# Altium schematic sheet RF.SchDoc
size Letter
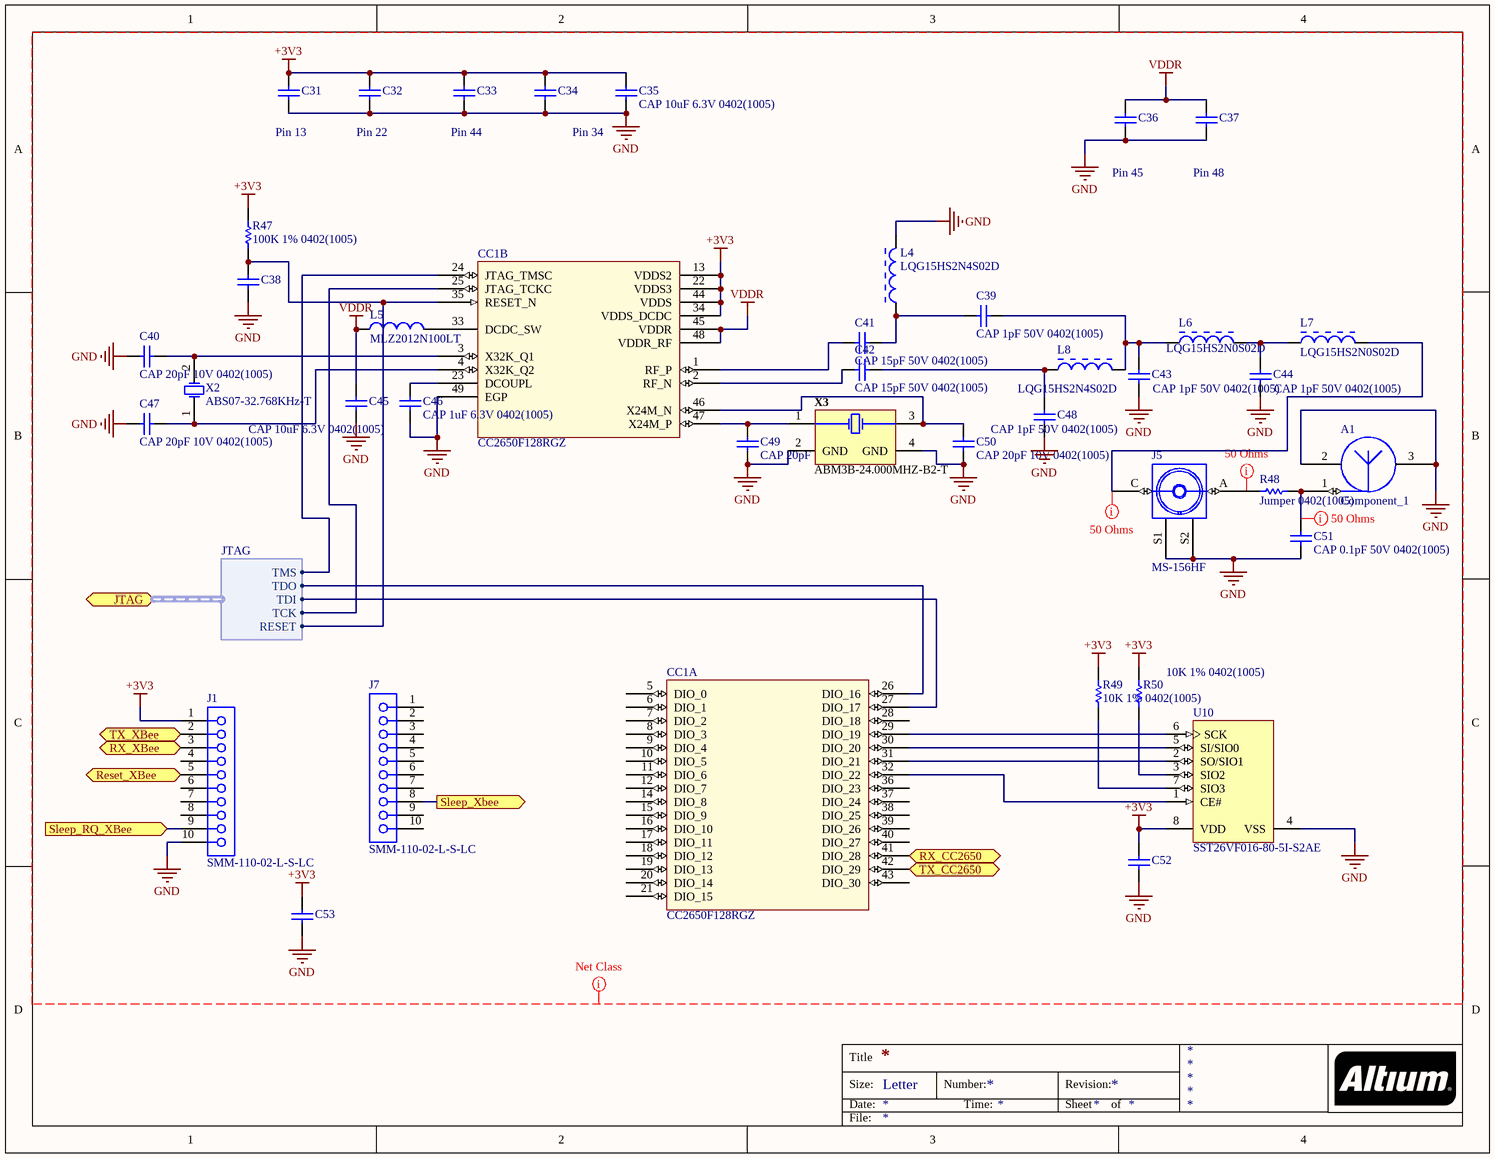
[diagram p0: RF.SchDoc]

## Parts
A1  Component_1  [Microstrip Antenna]  (net tie, no BOM)
C31  CAP 100nF 10V 0402(1005)  [CAPC0402(1005)60_L]  (value not drawn)
C32  CAP 100nF 10V 0402(1005)  [CAPC0402(1005)60_L]  (value not drawn)
C33  CAP 100nF 10V 0402(1005)  [CAPC0402(1005)60_L]  (value not drawn)
C34  CAP 100nF 10V 0402(1005)  [CAPC0402(1005)60_L]  (value not drawn)
C35  CAP 10uF 6.3V 0402(1005)  [CAPC0402(1005)60_L]
C36  CAP 100nF 10V 0402(1005)  [CAPC0402(1005)60_L]  (value not drawn)
C37  CAP 100nF 10V 0402(1005)  [CAPC0402(1005)60_L]  (value not drawn)
C38  CAP 100nF 10V 0402(1005)  [CAPC0402(1005)60_L]  (value not drawn)
C39  CAP 1pF 50V 0402(1005)  [CAPC0402(1005)33_L]
C40  CAP 20pF 10V 0402(1005)  [CAPC0402(1005)60_L]
C41  CAP 15pF 50V 0402(1005)  [CAPC0402(1005)33_L]
C42  CAP 15pF 50V 0402(1005)  [CAPC0402(1005)33_L]
C43  CAP 1pF 50V 0402(1005)  [CAPC0402(1005)33_L]
C44  CAP 1pF 50V 0402(1005)  [CAPC0402(1005)33_L]
C45  CAP 10uF 6.3V 0402(1005)  [CAPC0402(1005)60_L]
C46  CAP 1uF 6.3V 0402(1005)  [CAPC0402(1005)60_L]
C47  CAP 20pF 10V 0402(1005)  [CAPC0402(1005)60_L]
C48  CAP 1pF 50V 0402(1005)  [CAPC0402(1005)33_L]
C49  CAP 20pF 10V 0402(1005)  [CAPC0402(1005)60_L]
C50  CAP 20pF 10V 0402(1005)  [CAPC0402(1005)60_L]
C51  CAP 0.1pF 50V 0402(1005)  [CAPC0402(1005)33_L]
C52  CAP 100nF 10V 0402(1005)  [CAPC0402(1005)60_L]  (value not drawn)
C53  CAP 100nF 10V 0402(1005)  [CAPC0402(1005)60_L]  (value not drawn)
CC1  CC2650F128RGZ  [RGZ48-4100X4100TP]  (parts A,B of 2)
J1  SMM-110-02-L-S-LC  [SMTC-SMM-110-02-X-S-LC]
J5  MS-156HF  [MS-156HF]
J7  SMM-110-02-L-S-LC  [SMTC-SMM-110-02-X-S-LC]
L4  LQG15HS2N4S02D  [MURA-IND0402_V]
L5  MLZ2012N100LT  [TDK-IND0805-125_V]
L6  LQG15HS2N0S02D  [MURA-IND0402_V]
L7  LQG15HS2N0S02D  [MURA-IND0402_V]
L8  LQG15HS2N4S02D  [MURA-IND0402_V]
R47  100K 1% 0402(1005)  [RESC0402(1005)_L]
R48  Jumper 0402(1005)  [RESC0402(1005)_L]
R49  10K 1% 0402(1005)  [RESC0402(1005)_L]
R50  10K 1% 0402(1005)  [RESC0402(1005)_L]
U10  SST26VF016-80-5I-S2AE  [MCHP-SOIC-S2A8_L]
X2  ABS07-32.768KHz-T  [ABRA-ABS07-2_V]
X3  ABM3B-24.000MHZ-B2-T  [ABRA-ABM3B-4_V]

## Ports
JTAG (harness JTAG), Reset_XBee (in), RX_CC2650 (in), RX_XBee (in), Sleep_RQ_XBee (in), Sleep_Xbee (out), TX_CC2650 (out), TX_XBee (out)

## Harnesses
JTAG: RESET, TCK, TDI, TDO, TMS

## Nets
+3V3: C31.2 C32.2 C33.2 C34.2 C35.2 C52.2 C53.2 CC1.13(VDDS2) CC1.22(VDDS3) CC1.34(VDDS_DCDC) CC1.44(VDDS) J1.1 R47.2 R49.2 R50.2 U10.8(VDD)
GND: A1.2 A1.3 C31.1 C32.1 C33.1 C34.1 C35.1 C36.1 C37.1 C38.1 C40.1 C43.1 C44.1 C45.1 C46.1 C47.1 C48.1 C49.2 C50.2 C51.1 C52.1 C53.1 CC1.49(EGP) J1.10 J5.S1 J5.S2 L4.2 U10.4(VSS) X3.2(GND) X3.4(GND)
VDDR: C36.2 C37.2 C45.2 CC1.45(VDDR) CC1.48(VDDR_RF) L5.1
Reset_XBee: J1.5 ; port Reset_XBee
RX_CC2650: CC1.41(DIO_28) ; port RX_CC2650
RX_XBee: J1.3 ; port RX_XBee
Sleep_RQ_XBee: J1.9 ; port Sleep_RQ_XBee
Sleep_Xbee: J7.8 ; port Sleep_Xbee
TX_CC2650: CC1.42(DIO_29) ; port TX_CC2650
TX_XBee: J1.2 ; port TX_XBee
NetA1_1: A1.1 C51.2 R48.2
NetC38_2: C38.2 CC1.35(RESET_N) R47.1 ; port JTAG.RESET
NetC39_1: C39.1 C41.2 L4.1
NetC39_2: C39.2 C43.2 L6.1 L8.2
NetC40_2: C40.2 CC1.3(X32K_Q1) X2.2(X2)
NetC41_1: C41.1 CC1.1(RF_P)
NetC42_1: C42.1 CC1.2(RF_N)
NetC42_2: C42.2 C48.2 L8.1
NetC44_2: C44.2 L6.2 L7.1
NetC46_2: C46.2 CC1.23(DCOUPL)
NetC47_2: C47.2 CC1.4(X32K_Q2) X2.1(X1)
NetC49_1: C49.1 CC1.47(X24M_P) X3.1(X1)
NetC50_1: C50.1 CC1.46(X24M_N) X3.3(X2)
NetCC1_24: CC1.24(JTAG_TMSC) ; port JTAG.TMS
NetCC1_25: CC1.25(JTAG_TCKC) ; port JTAG.TCK
NetCC1_26: CC1.26(DIO_16) ; port JTAG.TDO
NetCC1_27: CC1.27(DIO_17) ; port JTAG.TDI
NetCC1_29: CC1.29(DIO_19) U10.6(SCK)
NetCC1_30: CC1.30(DIO_20) U10.5(SI/SIO0)
NetCC1_31: CC1.31(DIO_21) U10.2(SO/SIO1)
NetCC1_32: CC1.32(DIO_22) U10.1(CE#)
NetCC1_33: CC1.33(DCDC_SW) L5.2
NetJ5_A: J5.A R48.1
NetJ5_C: J5.C L7.2
NetR49_1: R49.1 U10.7(SIO3)
NetR50_1: R50.1 U10.3(SIO2)

Not connected (* = marked no-connect by the designer): CC1 5(DIO_0) 6(DIO_1) 7(DIO_2) 8(DIO_3) 9(DIO_4) 10(DIO_5) 11(DIO_6) 12(DIO_7) 14(DIO_8) 15(DIO_9) 16(DIO_10) 17(DIO_11) 18(DIO_12) 19(DIO_13) 20(DIO_14) 21(DIO_15) 28(DIO_18) 36(DIO_23) 37(DIO_24) 38(DIO_25) 39(DIO_26) 40(DIO_27) 43(DIO_30); J1 4 6 7 8; J7 1 2 3 4 5 6 7 9 10

## Layout directives
net class 50_Ohms: NetA1_1, NetJ5_A, NetJ5_C
net class RF: +3V3, GND, VDDR

## Notes on the sheet
- (near C31) Pin 13
- (near C32) Pin 22
- (near C33) Pin 44
- Pin 34
- (near C36) Pin 45
- (near C37) Pin 48
- Title
- Size:
- Date:
- Letter
- Number:
- Time:
- Revision:
- Sheet
- of
- File:

## Library data of the parts
C31-C34 C36-C38 C52 C53 = CMP-1034-02066-1: CAP 100nF 10V ±20% 0402 (1005 Metric) Thickness 0.6mm SMD; Tolerance: Â±20%; Case-Metric: 1005; Case-EIA: 0402; Max Thickness: 0.6 mm; Rated Voltage: 10 V; Technology: SMT; Value: 100nF
C35 C45 = CMP-1034-02138-1: CAP 10uF 6.3V ±20% 0402 (1005 Metric) Thickness 0.6mm SMD; Tolerance: Â±20%; Case-EIA: 0402; Case-Metric: 1005; Max Thickness: 0.6 mm; Rated Voltage: 6.3 V; Technology: SMT; Value: 10uF
C39 C43 C44 C48 = CMP-1034-00058-1: CAP 1pF 50V ±0.25pF 0402 (1005 Metric) Thickness 0.33mm SMD; Case-Metric: 1005; Case-EIA: 0402; Tolerance: Â±0.25pF; Technology: SMT; Max Thickness: 0.33 mm; Value: 1pF; Rated Voltage: 50 V
C40 C47 C49 C50 = CMP-1034-00874-1: CAP 20pF 10V ±5% 0402 (1005 Metric) Thickness 0.6mm SMD; Case-EIA: 0402; Tolerance: Â±5%; Case-Metric: 1005; Value: 20pF; Rated Voltage: 10 V; Technology: SMT; Max Thickness: 0.6 mm
C41 C42 = CMP-1034-00814-1: CAP 15pF 50V ±5% 0402 (1005 Metric) Thickness 0.33mm SMD; Tolerance: Â±5%; Case-Metric: 1005; Case-EIA: 0402; Max Thickness: 0.33 mm; Value: 15pF; Rated Voltage: 50 V; Technology: SMT
C46 = CMP-1034-02115-1: CAP 1uF 6.3V -20% to +80% 0402 (1005 Metric) Thickness 0.6mm SMD; Case-Metric: 1005; Case-EIA: 0402; Value: 1uF; Tolerance: -20% to +80%; Rated Voltage: 6.3 V; Max Thickness: 0.6 mm; Technology: SMT
C51 = CMP-1034-00002-1: CAP 0.1pF 50V ±0.1pF 0402 (1005 Metric) Thickness 0.33mm SMD; Case-EIA: 0402; Tolerance: Â±0.1pF; Case-Metric: 1005; Max Thickness: 0.33 mm; Technology: SMT; Value: 0.1pF; Rated Voltage: 50 V
CC1 = CMP-00021-0000-A.2: RF Microcontrollers - MCU SimpleLink multi-std Wireless MCU 2.4Ghz; Manufacturer Part Number: CC2650F128RGZT; Output Power: 5 dBm; Program Memory Type: Flash; Brand: Texas Instruments; Data RAM Size: 20 kB; Data RAM Type: SRAM; Interface Type: I2C, I2S, SSI, UART; Number of I/Os: 31 I/O; Program Memory Size: 128 kB; ADC Resolution: 12 bit; Core: ARM Cortex M3; Data Bus Width: 32 bit; Maximum Clock Frequency: 48 MHz; Number of ADC Channels: 8; Number of Timers: 4 Timer; Operating Supply Voltage: 1.7 V to 3.8 V; Processor Series: CC26xx; Product Status: New Product; Operating Frequency: 2.4 GHz; Package / Case: VQFN-48; Packaging: Reel; Series: CC2650; Mounting Style: SMD/SMT; Manufacturer: Texas Instruments; Standard Pack Qty: 250; Tradename: SimpleLink; RoHS - Mouser: Y; Minimum Order Quantity: 1; Reeling: True; Supplier: Mouser; Supplier Part Number: 595-CC2650F128RGZT
J1 J7 = CMP-1022-00175-1: Tiger Eye(TM) Socket Strip, Surface Mount, Vertical, -55 to 125 degC, 2 mm Pitch, 10-Pin, Female, RoHS; Manufacturer: Samtec; Pitch: 2 mm; ComponentLink1Description: Manufacturer URL; PackageVersion: BC, 5/1991; PackageDescription: 2 mm Socket Strip (Single Row); ComponentLink2Description: Datasheet; ComponentLink3URL: http://www.samtec.com/documents/webfiles/cpdf/SMM-1XX-XX-XX-S-XX-X-XX-XX-MKT.pdf; ComponentLink2URL: http://www.samtec.com/documents/webfiles/pdf/SMM.PDF; PackageReference: SMM-110-02-X-S-LC; Temperature Range: -55 to 125 degC; Orientation: Vertical; PartNumber: SMM-110-02-L-S-LC; RoHS: True; Mounting Technology: Surface Mount; DatasheetVersion: F-214; ComponentLink3Description: Package Specification; ComponentLink1URL: http://www.samtec.com
J5 = MS-156HF: Subminiature Coaxial Swtich, 1.6mm High, DC - 6GHz
L4 L8 = CMP-0499-00001-3: Chip Inductor (Chip Coil) for High Frequency Multilayer, 2.4 +/- 0.3 nH, 300 mA, 0402 (1005), 180mm Paper Tape; Manufacturer: Murata; Self Resonance Frequency (min.): 6000 MHz; Inductance Test Frequency: 100 MHz; Inductance: 2.4 nH +/- 0.3 nH; Rated Current (Itemp) (Based on Temperature rise): 300 mA; Max. Of DC Resistance: 0.1 ohm; Q (min.): 8; Operating Temperature Range: -55 to 125 degC; Mounting Technology: Surface Mount; PackageDescription: 2-Pin SMT Inductor, 1 x 0.5 mm Body; ComponentLink2URL: http://search.murata.co.jp/Ceramy/image/img/PDF/ENG/L0075S0083LQG15HS.pdf; ComponentLink1Description: Manufacturer URL; ComponentLink3URL: http://search.murata.co.jp/Ceramy/image/img/PDF/ENG/L0075S0083LQG15HS.pdf; ComponentLink1URL: http://www.murata.com/; ComponentLink2Description: Datasheet; RoHS: Yes; ComponentLink3Description: Package Specification; Q Test Frequency: 100 MHz; PackageReference: IND0402; PartNumber: LQG15HS2N4S02D
L5 = CMP-0266-00001-1: Multilayer Inductor, 10 uH, ±20%, 300 mOhm, 50MHz, 0805(2012); DC Resistance: 0.3 Ohm; PackageReference: IND0805-125; ComponentLink1URL: http://www.global.tdk.com/; DatasheetVersion: 05/2013; ComponentLink2Description: Datasheet; ComponentLink1Description: Manufacturer URL; Mounting Technology: Suface Mount; ComponentLink2URL: http://www.tdk.co.jp/tcfx01/c533_mlz.pdf; PartNumber: MLZ2012N100LT; PackageDescription: 2-Pin SMT Inductor, 2 x 1.25 mm Body
L6 L7 = CMP-0499-00001-3: Chip Inductor (Chip Coil) for High Frequency Multilayer, 2 +/- 0.3 nH, 300 mA, 0402 (1005), 180mm Paper Tape; Manufacturer: Murata; Self Resonance Frequency (min.): 6000 MHz; Inductance Test Frequency: 100 MHz; Inductance: 2.0 nH +/- 0.3 nH; Rated Current (Itemp) (Based on Temperature rise): 300 mA; Max. Of DC Resistance: 0.1 ohm; Q (min.): 8; Operating Temperature Range: -55 to 125 degC; Mounting Technology: Surface Mount; PackageDescription: 2-Pin SMT Inductor, 1 x 0.5 mm Body; ComponentLink2URL: http://search.murata.co.jp/Ceramy/image/img/PDF/ENG/L0075S0083LQG15HS.pdf; ComponentLink1Description: Manufacturer URL; ComponentLink3URL: http://search.murata.co.jp/Ceramy/image/img/PDF/ENG/L0075S0083LQG15HS.pdf; ComponentLink1URL: http://www.murata.com/; ComponentLink2Description: Datasheet; RoHS: Yes; ComponentLink3Description: Package Specification; Q Test Frequency: 100 MHz; PackageReference: IND0402; PartNumber: LQG15HS2N0S02D
R47 = CMP-1011-00736-1: 100K 0.063W 1% 0402 (1005 Metric)  SMD; Value: 100000.00 Ohm; Case-Metric: 1005; Case-EIA: 0402; Power: 0.063 W; Tolerance: 1 %; Technology: SMT
R48 = CMP-1011-00001-1: Jumper 0402 (1005 Metric); Tolerance: None; Case-Metric: 1005; Case-EIA: 0402; Value: 0.00 Ohm; Power: None; Technology: SMT
R49 R50 = CMP-1011-00623-1: 10K 0.063W 1% 0402 (1005 Metric)  SMD; Case-EIA: 0402; Value: 10000.00 Ohm; Case-Metric: 1005; Technology: SMT; Tolerance: 1 %; Power: 0.063 W
U10 = CMP-0378-00053-1: 16 Mbit Serial Quad I/O (SQI) Flash Memory, 2.7 to 3.6 V, 80 MHz, -40 to 85 degC, 8-pin SOIC (S2A8), Tube; Manufacturer: Microchip; ComponentLink2URL: http://ww1.microchip.com/downloads/en/DeviceDoc/25017A.pdf; PackageVersion: Rev. A; PackageDescription: 8-Lead Plastic Small Outline Intergrated Circuit, 5.275 x 5.275 mm Body, 1.27 mm Pitch; ComponentLink3Description: Package Specification; PartNumber: SST26VF016-80-5I-S2AE; ComponentLink1Description: Manufacturer URL; PackageReference: SOIC-S2A8; Mounting Technology: Surface Mount; ComponentLink3URL: http://ww1.microchip.com/downloads/en/DeviceDoc/25051A.pdf; DatasheetVersion: Rev. A; ComponentLink2Description: Datasheet; ComponentLink4URL: http://www.microchip.com/SST26VF016; ComponentLink1URL: http://www.microchip.com; ComponentLink4Description: Product URL
X2 = CMP-0447-00001-2: Crystal, 32.768 kHz, 12.5 pF, -40 to 85 degC, SMD Low Profile 3.2 x 1.5 x 0.9 mm, Tape and Reel; Manufacturer: Abracon; Q Value (Type): 30000; Operation Mode: Flexural Mode (Tuning Fork); Shunt Capacitance (C0): 0.9 to 1.2 pF; Load Capacitance (CL): 12.5 pF; Frequency Tolerance @+25degC: +/- 20 ppm; Drive Level (Type): 0.1 uW; Equivalent Series Resistance (R1): 70 Kohm; Insulation Resistance (Min): 500 Mohm; ComponentLink3URL: http://www.abracon.com/Resonators/ABS07.pdf; PackageDescription: 2-Pin Hand Drawn, Body 3.2x1.5mm, Pitch 2.5mm; Operating Temperature: -40 to 85 degC; ComponentLink2URL: http://www.abracon.com/Resonators/ABS07.pdf; PackageReference: ABS07-2; ComponentLink3Description: Package Specification; ComponentLink1Description: Manufacturer URL; DatasheetVersion: 04.03.13; Mounting Technology: Surface Mount; ComponentLink2Description: Datasheet; ComponentLink1URL: http://www.abracon.com/; PartNumber: ABS07-32.768KHz-T; Packing: Tape and Reel; Frequency: 32.768 kHz
X3 = CMP-1688-00008-1: Ceramic SMD Crystal, 24 MHz, +/- 20 ppm, 50 Ohm, -20 to 70 degC, 4-Pin SMD, RoHS, Tape and Reel; Impedance: 50 Ohm; Mating Cycles: 30; Frequency: 6 Hz; Contact Material: Brass; Contact Plating: Gold; PackageReference: ABM3B; Min Operating Temperature: -40 degC; ComponentLink2Description: Datasheet; Radiation Hardening: No; DatasheetVersion: Aug-15; Packaging: Tape and Reel; Length: 2.6 mm; Package Quantity: 2500; REACH SVHC: Unknown; PackageDescription: 4-Pin Surface Mount Device, Body 5 x 3.2 mm; Weight: 0.001058 oz; ComponentLink2URL: http://www.abracon.com/Resonators/abm3b.pdf; ComponentLink1Description: Manufacturer URL; Width: 3 mm; RoHSCompliant: true; Fastening Type: Snap; Max Operating Temperature: 155 degC; ComponentLink1URL: http://www.abracon.com/; Height: 1.244 mm; Mount: Surface Mount